# EAGLE design Schematic (EAGLE 9.6.2)
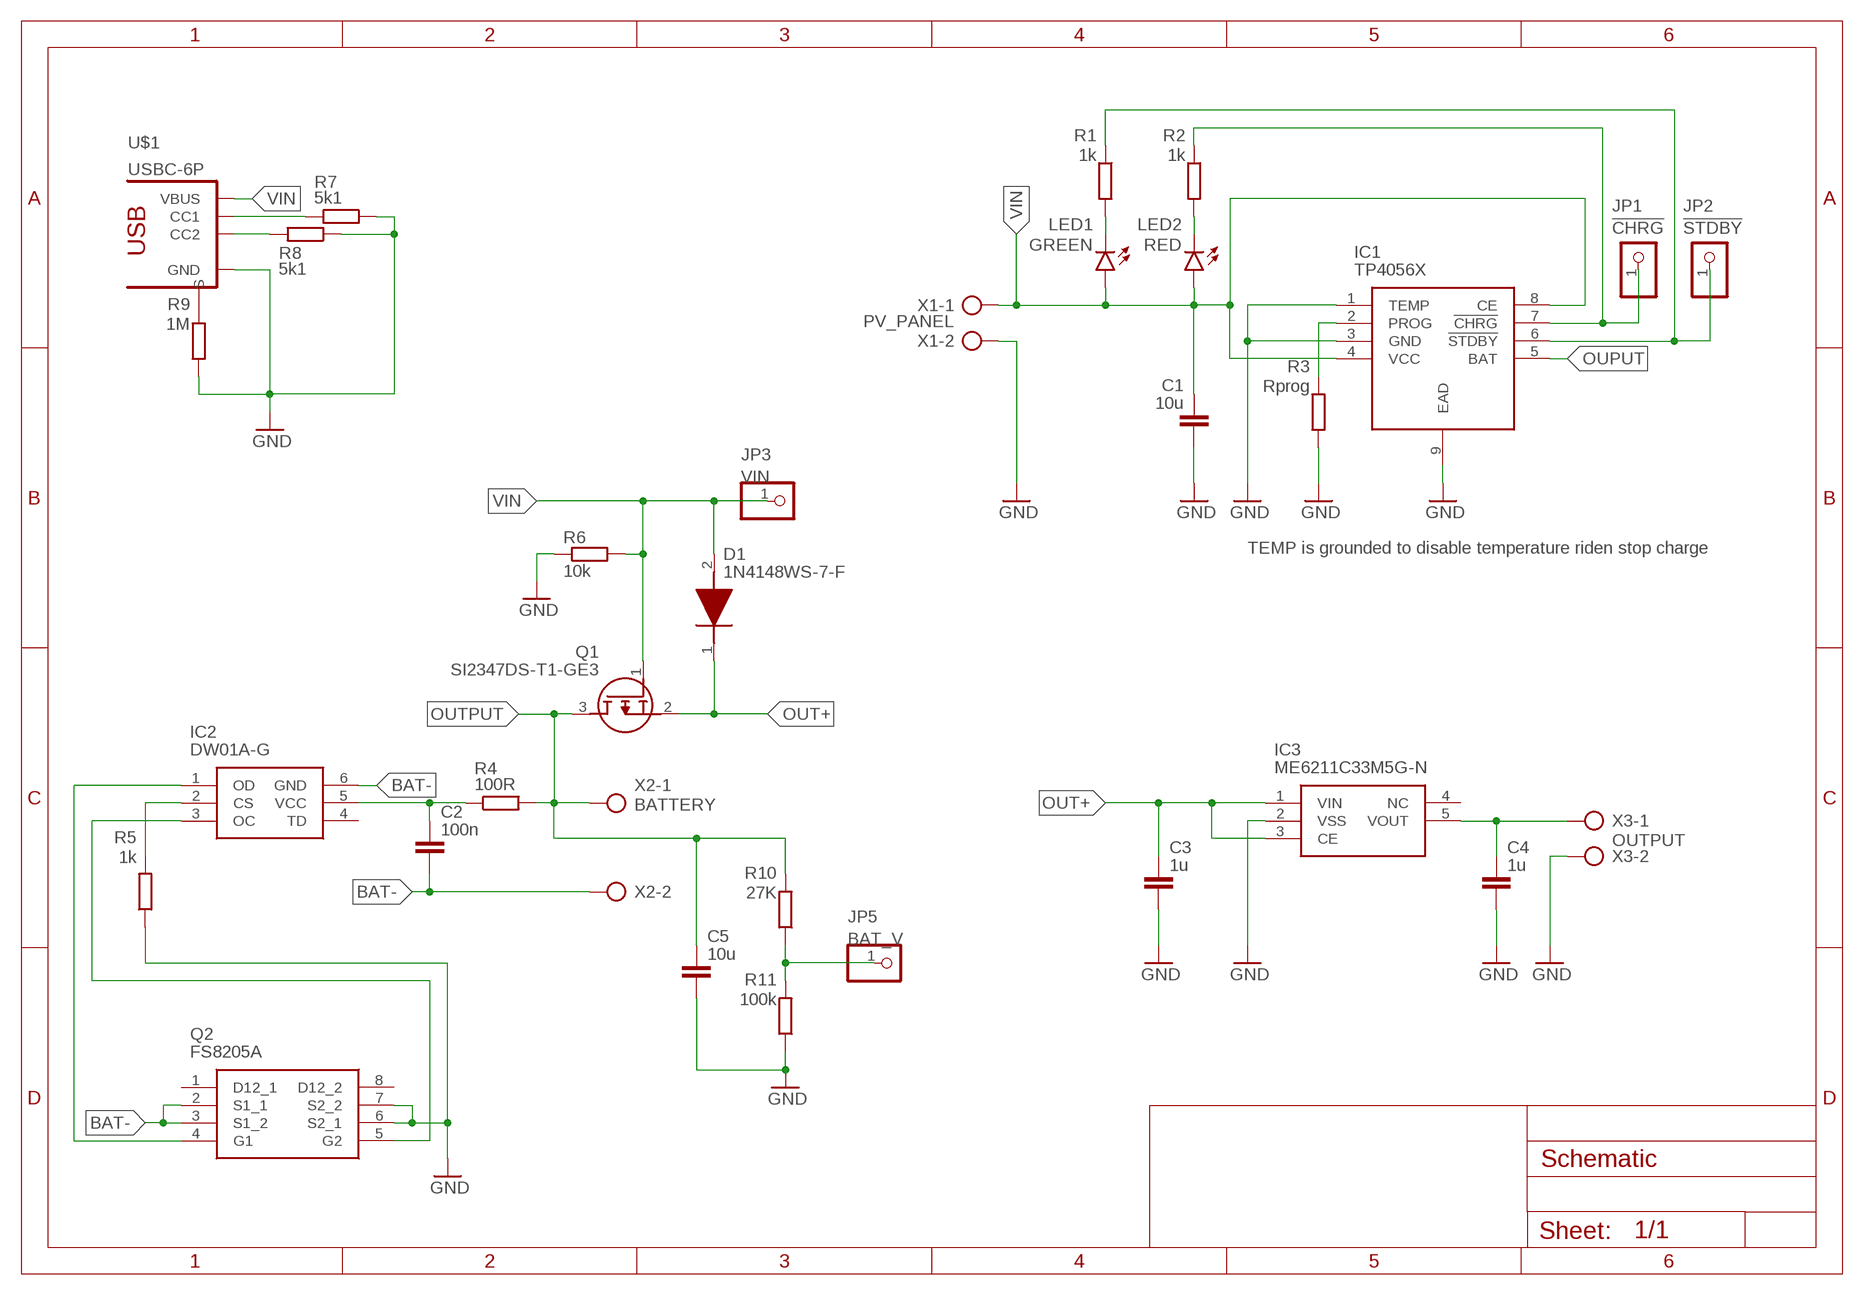
[diagram p0: schematic, sheet 1]

## Parts
C1  10u  C-EUC0805  [C0805]
C2  100n  C-EUC0805  [C0805]
C3  1u  C-EUC0805  [C0805]
C4  1u  C-EUC0805  [C0805]
C5  10u  C-EUC0805  [C0805]
D1  1N4148WS-7-F  [SOD2513X120N]
IC1  TP4056X  [SOIC127P600X175-9N]
IC2  DW01A-G  [SOT95P280X135-6N]
IC3  ME6211C33M5G-N  [SOT95P270X145-5N]
JP1  !CHRG  PINHD-1X1  [1X01]
JP2  !STDBY  PINHD-1X1  [1X01]
JP3  VIN  PINHD-1X1  [1X01]
JP5  BAT_V  PINHD-1X1  [1X01]
LED1  GREEN  LEDCHIPLED_0805  [CHIPLED_0805]
LED2  RED  LEDCHIPLED_0805  [CHIPLED_0805]
Q1  SI2347DS-T1-GE3  [SOT95P237X112-3N]
Q2  FS8205A  [SOP65P640X120-8N]
R1  1k  R-EU_R0805  [R0805]
R2  1k  R-EU_R0805  [R0805]
R3  Rprog  R-EU_R0805  [R0805]
R4  100R  R-EU_R0805  [R0805]
R5  1k  R-EU_R0805  [R0805]
R6  10k  R-EU_R0805  [R0805]
R7  5k1  R-EU_R0805  [R0805]
R8  5k1  R-EU_R0805  [R0805]
R9  1M  R-EU_R0805  [R0805]
R10  27K  R-EU_R0805  [R0805]
R11  100k  R-EU_R0805  [R0805]
U$1  USBC-6P  [USCX-06FX-XXMX-01]
X1  PV_PANEL  AK300/2  [AK300/2]
X2  BATTERY  AK300/2  [AK300/2]
X3  OUTPUT  AK300/2  [AK300/2]

## Nets
BAT-: C2.2 IC2.6(GND) Q2.2(S1_1) Q2.3(S1_2) X2.2
GND: C1.2 C3.2 C4.2 C5.2 IC1.1(TEMP) IC1.3(GND) IC1.9(EAD) IC3.2(VSS) Q2.6(S2_1) Q2.7(S2_2) R3.2 R5.1 R6.1 R7.1 R8.1 R9.2 R11.1 U$1.GND1(GND) U$1.GND2(GND) X1.2 X3.2
N$1: LED1.C R1.2
N$2: LED2.C R2.2
N$3: IC1.6(!STDBY) JP2.1 R1.1
N$4: IC1.2(PROG) R3.1
N$5: C2.1 IC2.5(VCC) R4.1
N$6: IC1.7(!CHRG) JP1.1 R2.1
N$7: R9.1 U$1.SHIELD1(S) U$1.SHIELD2(S) U$1.SHIELD3(S) U$1.SHIELD4(S)
N$8: R8.2 U$1.CC2
N$9: IC2.2(CS) R5.2
N$10: IC2.1(OD) Q2.4(G1)
N$11: R7.2 U$1.CC1
N$12: IC2.3(OC) Q2.5(G2)
N$14: C4.1 IC3.5(VOUT) X3.1
N$15: JP5.1 R10.1 R11.2
OUPUT: IC1.5(BAT)
OUT+: C3.1 D1.1(K) IC3.1(VIN) IC3.3(CE) Q1.2(S)
OUTPUT: C5.1 Q1.3(D) R4.2 R10.2 X2.1
VIN: C1.1 D1.2(A) IC1.4(VCC) IC1.8(CE) JP3.1 LED1.A LED2.A Q1.1(G) R6.2 U$1.VBUS1(VBUS) U$1.VBUS2(VBUS) X1.1
Unconnected: IC2.4(TD) IC3.4(NC) Q2.1(D12_1) Q2.8(D12_2)

## Notes on the sheet
- TEMP is grounded to disable temperature riden stop charge

## Library data of the parts
C1-C5 = rcl:C-EU: CAPACITOR, European symbol; SPICEPREFIX: C
D1 = 1-component-search:1N4148WS-7-F: Diode Switching 150mA 75V 200mW SOD323 Diodes Inc 1N4148WS-7-F Switching Diode, 150mA 75V, 2-Pin SOD-323 Source: Datasheet <https://componentsearchengine.com/Datasheets/2/1N4148WS-7-F.pdf>; ARROW_PART_NUMBER: 1N4148WS-7-F; ARROW_PRICE-STOCK: https://www.arrow.com/en/products/1n4148ws-7-f/diodes-incorporated?region=nac; DESCRIPTION: Diode Switching 150mA 75V 200mW SOD323 Diodes Inc 1N4148WS-7-F Switching Diode, 150mA 75V, 2-Pin SOD-323; HEIGHT: 1.2mm; MANUFACTURER_NAME: Diodes Inc.; MANUFACTURER_PART_NUMBER: 1N4148WS-7-F; MOUSER_PART_NUMBER: 621-1N4148WS-F; MOUSER_PRICE-STOCK: https://www.mouser.co.uk/ProductDetail/Diodes-Incorporated/1N4148WS-7-F?qs=4drIV0IxA0r8aNy7%2Fu4kVw%3D%3D
IC1 = TP4056X:TP4056X: PMIC - Battery Management SOP-8_EP_150mil RoHS Source: Datasheet <https://datasheet.lcsc.com/szlcsc/Nanjing-Extension-Microelectronics-TP4056X_C191323.pdf>; DESCRIPTION: PMIC - Battery Management SOP-8_EP_150mil RoHS; HEIGHT: 1.75mm; MANUFACTURER_NAME: Nanjing Extension Microelectronics; MANUFACTURER_PART_NUMBER: TP4056X
IC2 = 1-component-search:DW01A-G: One Cell Lithium-ion/Polymer Battery Protection IC Source: Datasheet <http://acoptex.com/uploads/DW01A.pdf>; DESCRIPTION: One Cell Lithium-ion/Polymer Battery Protection IC; HEIGHT: 1.35mm; MANUFACTURER_NAME: Fortune Semiconductor Corporation; MANUFACTURER_PART_NUMBER: DW01A-G
IC3 = 1-component-search:ME6211C33M5G-N: Fixed 6V 3.3V 500mA SOT-23-5 Low Dropout Regulators(LDO) RoHS Source: Datasheet <https://datasheet.lcsc.com/szlcsc/1811131510_MICRONE-Nanjing-Micro-One-Elec-ME6211C33M5G-N_C82942.pdf>; DESCRIPTION: Fixed 6V 3.3V 500mA SOT-23-5 Low Dropout Regulators(LDO) RoHS; HEIGHT: 1.45mm; MANUFACTURER_NAME: Microne; MANUFACTURER_PART_NUMBER: ME6211C33M5G-N
JP1 JP2 JP5 = pinhead:PINHD-1X1: PIN HEADER
JP3 = pinhead:PINHD-1X1: PIN HEADER; SPICEPREFIX: X
LED1 LED2 = led:LED: LED OSRAM: - CHIPLED LG R971, LG N971, LY N971, LG Q971, LY Q971, LO R971, LY R971 LH N974, LH R974 LS Q976, LO Q976, LY Q976 LO Q996 - Hyper CHIPLED LW Q18S LB Q993, LB Q99A, LB R99A - SideLED LS A670, LO A670, LY A670, LG A670, LP A670 LB A673, LV A673, LT A673, LW A673 LH A674 LY A675 LS A676, LA A676, LO A676, LY A676, LW A676 LS A679, LY A679, LG A679 - Hyper Micro SIDELED® LS Y876, LA Y876, LO Y876, LY Y876 LT Y87S - SmartLED LW L88C, LW L88S LB L89C, LB L89S, LG L890 LS L89K, LO L89K, LY L89K LS L896, LA L896, LO L896, LY L896 - TOPLED LS T670, LO T670, LY T670, LG T670, LP T670 LSG T670, LSP T670, LSY T670, LOP T670, LYG T670 LG T671, LOG T671, LSG T671 LB T673, LV T673, LT T673, LW T673 LH T674 LS T676, LA T676, LO T676, LY T676, LB T676, LH T676, LSB T676, LW T676 LB T67C, LV T67C, LT T67C, LS T67K, LO T67K, LY T67K, LW E67C LS E67B, LA E67B, LO E67B, LY E67B, LB E67C, LV E67C, LT E67C LW T67C LS T679, LY T679, LG T679 LS T770, LO T770, LY T770, LG T770, LP T770 LB T773, LV T773, LT T773, LW T773 LH T774 LS E675, LA E675, LY E675, LS T675 LS T776, LA T776, LO T776, LY T776, LB T776 LHGB T686 LT T68C, LB T68C - Hyper Mini TOPLED® LB M676 - Mini TOPLED Santana® LG M470 LS M47K, LO M47K, LY M47K Source: http://www.osram.convergy.de LUXEON: - LUMILED® LXK2-PW12-R00, LXK2-PW12-S00, LXK2-PW14-U00, LXK2-PW14-V00 LXK2-PM12-R00, LXK2-PM12-S00, LXK2-PM14-U00 LXK2-PE12-Q00, LXK2-PE12-R00, LXK2-PE12-S00, LXK2-PE14-T00, LXK2-PE14-U00 LXK2-PB12-K00, LXK2-PB12-L00, LXK2-PB12-M00, LXK2-PB14-N00, LXK2-PB14-P00, LXK2-PB14-Q00 LXK2-PR12-L00, LXK2-PR12-M00, LXK2-PR14-Q00, LXK2-PR14-R00 LXK2-PD12-Q00, LXK2-PD12-R00, LXK2-PD12-S00 LXK2-PH12-R00, LXK2-PH12-S00 LXK2-PL12-P00, LXK2-PL12-Q00, LXK2-PL12-R00 Source: www.luxeon.com KINGBRIGHT: KA-3528ASYC Source: www.kingbright.com
Q1 = 1-component-search:SI2347DS-T1-GE3: P-Ch MOSFET SOT-23 copper 30V 42mohm @ 1 Source: Datasheet <https://www.vishay.com/docs/62827/si2347ds.pdf>; ARROW_PART_NUMBER: SI2347DS-T1-GE3; ARROW_PRICE-STOCK: https://www.arrow.com/en/products/si2347ds-t1-ge3/vishay?region=nac; DESCRIPTION: P-Ch MOSFET SOT-23 copper 30V 42mohm @ 1; HEIGHT: 1.12mm; MANUFACTURER_NAME: Vishay; MANUFACTURER_PART_NUMBER: Si2347DS-T1-GE3; MOUSER_PART_NUMBER: 78-SI2347DS-T1-GE3; MOUSER_PRICE-STOCK: https://www.mouser.co.uk/ProductDetail/Vishay-Semiconductors/SI2347DS-T1-GE3?qs=wnm%2FPMJNddFQv4lfacOrcA%3D%3D
Q2 = 1-component-search:FS8205A: Dual N-Channel Enahncement Mode Power MOSFET Source: Datasheet <http://www.ic-fortune.com/upload/Download/FS8205A-DS-12_EN.pdf>; DESCRIPTION: Dual N-Channel Enahncement Mode Power MOSFET; HEIGHT: 1.2mm; MANUFACTURER_NAME: fortune; MANUFACTURER_PART_NUMBER: FS8205A
R1-R11 = rcl:R-EU_: RESISTOR, European symbol; SPICEPREFIX: R
U$1 = USBC6P:USBC-6P: AliExpress Special! Connect 5.1k 10% resistors to each CC pin, pulled up to 3.3v or 5.0v.
X1-X3 = con-ptr500:AK300/2: CONNECTOR; OC_FARNELL: unknown; OC_NEWARK: unknown

## Board
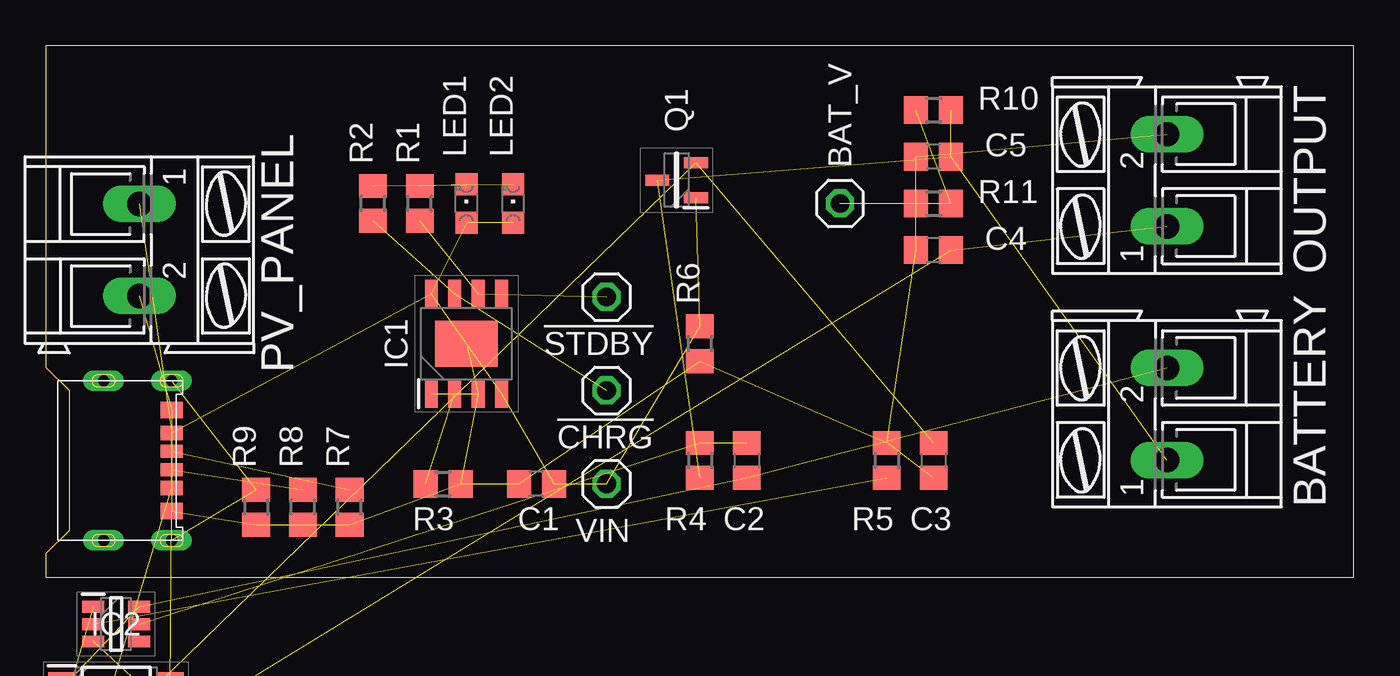
[diagram p1: board, top side]
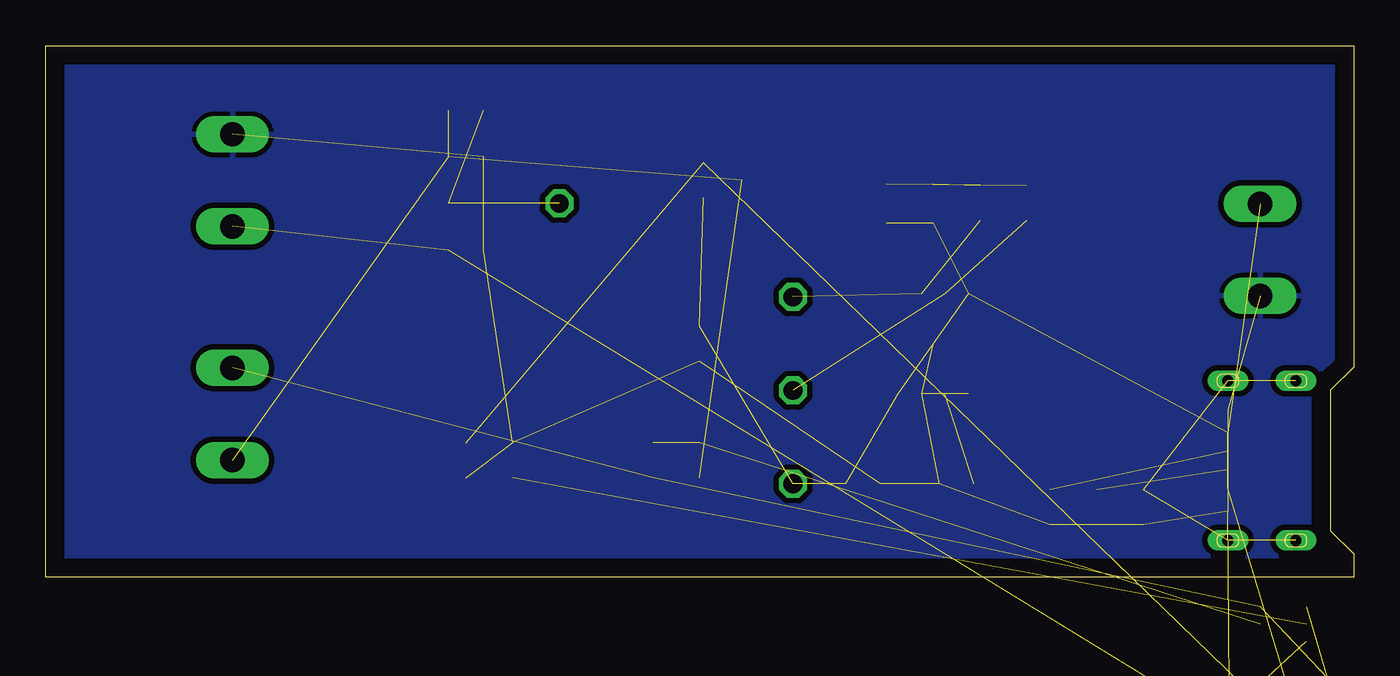
[diagram p2: board, bottom side, seen from below]

Size 71.1 x 28.88 mm. Coordinates in mm from the lower left corner, seen from the top.
Outline: 0,0 71.1,0 71.1,28.88 0,28.88 0,11.43 1.27,10.16 1.27,2.54 0,1.27 0,0
Copper layers (1*16): Top 0.035mm / dielectric 1.5mm / Bottom 0.035mm
Design rules "default *": minimum track width 10mil, minimum drill 0.35mm, track to track 10mil, track to pad 10mil, pad to pad 10mil, via to via 10mil, smd to smd 10mil, copper to edge 40mil, drill to drill 6mil, minimum pad ring 10mil, minimum via ring 8mil, stop-mask expansion 4mil, vias tented up to drill 0mil, thermal gap 10mil

### Footprints (pad centres in the part's own frame; a part is rotated, then mirrored left to right if it is on the bottom)
C0805 = smd 1.3 x 1.5: 1 -0.95,0; 2 0.95,0
SOD2513X120N = smd 1.075 x 0.5: 1 -1.162,0; 2 1.162,0
SOIC127P600X175-9N = smd 1.525 x 0.7: 1 -2.712,1.905; 2 -2.712,0.635; 3 -2.712,-0.635; 4 -2.712,-1.905; 5 2.712,-1.905; 6 2.712,-0.635; 7 2.712,0.635; 8 2.712,1.905 | smd 2.513 x 3.402: 9 0,0
SOT95P280X135-6N = smd 1.2 x 0.65: 1 -1.25,0.95; 2 -1.25,0; 3 -1.25,-0.95; 4 1.25,-0.95; 5 1.25,0; 6 1.25,0.95
SOT95P270X145-5N = smd 1.4 x 0.6: 1 -1.25,0.95; 2 -1.25,0; 3 -1.25,-0.95; 4 1.25,-0.95; 5 1.25,0.95
1X01 = drill 1.016 octagon: 1 0,0
CHIPLED_0805 = smd 1.2 x 1.2: A 0,-1.05; C 0,1.05
SOT95P237X112-3N = smd 1.3 x 0.6: 1 -1.05,0.95; 2 -1.05,-0.95; 3 1.05,0
SOP65P640X120-8N = smd 1.475 x 0.45: 1 -2.938,0.975; 2 -2.938,0.325; 3 -2.938,-0.325; 4 -2.938,-0.975; 5 2.938,-0.975; 6 2.938,-0.325; 7 2.938,0.325; 8 2.938,0.975
R0805 = smd 1.3 x 1.5: 1 -0.95,0; 2 0.95,0
USCX-06FX-XXMX-01 = smd 0.7 x 1.2: CC1 0.5,-1.75; CC2 -0.5,-1.75 | smd 0.9 x 1.2: GND1 2.75,-1.75; GND2 -2.75,-1.75 | drill 0.6 long: SHIELD1 4.325,1.95; SHIELD2 4.325,-1.75; SHIELD3 -4.35,-1.75; SHIELD4 -4.35,1.95 | smd 0.8 x 1.2: VBUS1 1.5,-1.75; VBUS2 -1.5,-1.75
AK300/2 = drill 1.321 long: 1 -2.515,0; 2 2.489,0

### Placement (x,y rotation side)
C1  26.67,5.08 180 top
C2  38.1,6.35 270 top
C3  48.26,6.35 270 top
C4  48.26,17.78 180 top
C5  48.26,22.86 180 top
D1  0,-13.97 0 top  (outside the outline)
IC1  22.86,12.7 90 top
IC2  3.81,-2.54 0 top
IC3  3.81,-10.16 0 top  (outside the outline)
JP1  30.48,10.16 90 top
JP2  30.48,15.24 90 top
JP3  30.48,5.08 90 top
JP5  43.18,20.32 180 top
LED1  22.86,20.32 0 top
LED2  25.4,20.32 0 top
Q1  34.29,21.59 180 top
Q2  3.81,-6.35 0 top  (outside the outline)
R1  20.32,20.32 90 top
R2  17.78,20.32 90 top
R3  21.59,5.08 0 top
R4  35.56,6.35 270 top
R5  45.72,6.35 270 top
R6  35.56,12.7 90 top
R7  16.51,3.81 90 top
R8  13.97,3.81 90 top
R9  11.43,3.81 270 top
R10  48.26,25.4 0 top
R11  48.26,20.32 0 top
U$1  5.08,6.35 90 top
X1  5.08,17.78 270 top
X2  60.96,8.89 90 top
X3  60.96,21.59 90 top

### Tracks (layer width: path | path; a pad name or v marks a point on that pad's centre or on a via)
BAT-  (4 unrouted)
GND  (20 unrouted)
  pour Bottom (isolate 0.305): 0,0 0,1.27 1.27,2.54 1.27,10.16 0,11.43 0,29.21 71.12,29.21 71.12,0
N$1  (1 unrouted)
N$2  (1 unrouted)
N$3  (2 unrouted)
N$4  (1 unrouted)
N$5  (2 unrouted)
N$6  (2 unrouted)
N$7  (4 unrouted)
N$8  (1 unrouted)
N$9  (1 unrouted)
N$10  (1 unrouted)
N$11  (1 unrouted)
N$12  (1 unrouted)
N$14  (2 unrouted)
N$15  (2 unrouted)
OUT+  (4 unrouted)
OUTPUT  (4 unrouted)
VIN  (11 unrouted)